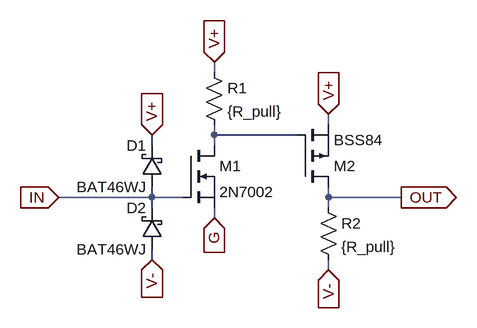
[diagram p0: schematic tri_sel2.asc]
tri_sel2.asc, the LTspice schematic file:
Version 4
SHEET 1 880 680
WIRE 32 16 32 0
WIRE 208 96 208 80
WIRE 32 112 32 96
WIRE 160 112 32 112
WIRE -64 128 -64 112
WIRE 32 128 32 112
WIRE -64 208 -64 192
WIRE -64 208 -208 208
WIRE -16 208 -64 208
WIRE 208 208 208 192
WIRE 320 208 208 208
WIRE -64 224 -64 208
WIRE 208 224 208 208
WIRE 32 240 32 224
WIRE -64 304 -64 288
WIRE 208 320 208 304
FLAG -64 112 V+
IOPIN -64 112 In
FLAG -64 304 V-
IOPIN -64 304 In
FLAG 32 240 G
IOPIN 32 240 In
FLAG -208 208 IN
IOPIN -208 208 In
FLAG 320 208 OUT
IOPIN 320 208 Out
FLAG 208 320 V-
IOPIN 208 320 In
FLAG 32 0 V+
IOPIN 32 0 In
FLAG 208 80 V+
IOPIN 208 80 In
SYMBOL nmos -16 128 R0
SYMATTR InstName M1
SYMATTR Value 2N7002
SYMBOL schottky -48 192 R180
WINDOW 0 24 64 Left 2
WINDOW 3 24 0 Left 2
SYMATTR InstName D1
SYMATTR Value BAT46WJ
SYMATTR Description Diode
SYMATTR Type diode
SYMBOL schottky -48 288 R180
WINDOW 0 24 64 Left 2
WINDOW 3 24 0 Left 2
SYMATTR InstName D2
SYMATTR Value BAT46WJ
SYMATTR Description Diode
SYMATTR Type diode
SYMBOL res 16 0 R0
SYMATTR InstName R1
SYMATTR Value {R_pull}
SYMBOL pmos 160 192 M180
SYMATTR InstName M2
SYMATTR Value BSS84
SYMBOL res 192 208 R0
SYMATTR InstName R2
SYMATTR Value {R_pull}

The netlist it stands for:
* tri_sel2.asc
M1 N001 IN G G 2N7002
D1 IN V+ BAT46WJ
D2 V- IN BAT46WJ
R1 V+ N001 {R_pull}
M2 OUT N001 V+ V+ BSS84
R2 OUT V- {R_pull}
.model D D
.lib standard.dio
.model NMOS NMOS
.model PMOS PMOS
.lib standard.mos
.backanno
.end